# Altium schematic sheet E17-15-CONN.SchDoc
size A; DocumentNumber: 3; SheetNumber: 3; SheetTotal: 9
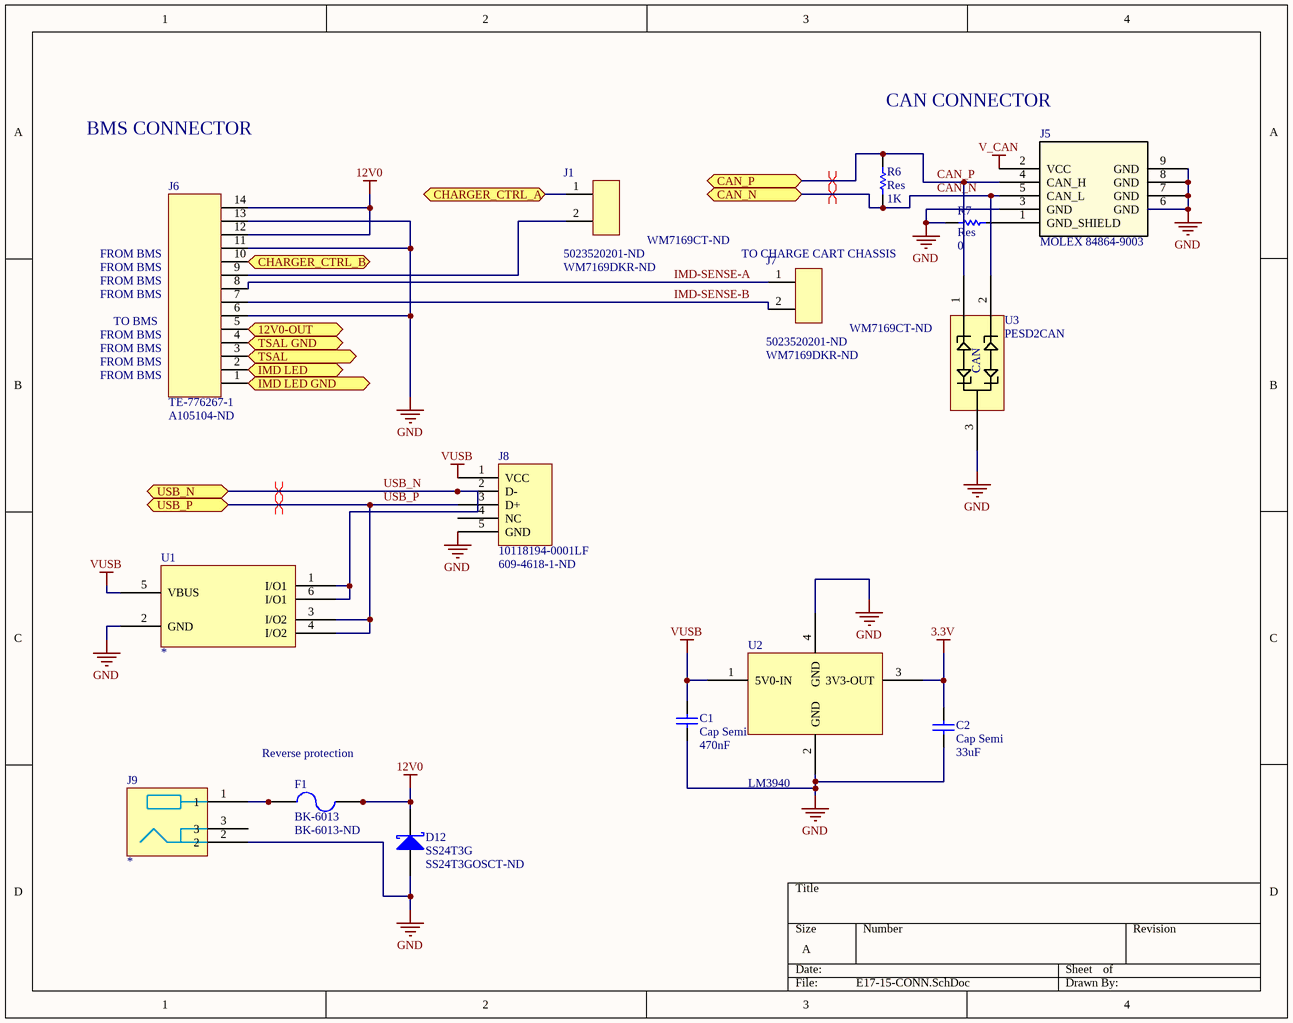
[diagram p0: E17-15-CONN.SchDoc]

## Parts
C1  Cap Semi  value 470nF  [C1206]
C2  Cap Semi  value 33uF  [C1206]
D12  SS24T3G  Supplier Part Number 1: SS24T3GOSCT-ND  [DO-214-AA]
F1  BK-6013  Supplier Part Number 1: BK-6013-ND  [BK-6013]
J1  Supplier Part Number 1: 5023520201-ND  Supplier Part Number 2: WM7169DKR-ND  [MOLEX_DURACLIK_2]  (hidden comment: J_5023520200)
J5  MOLEX 84864-9003  [MOLEX 84864-9003]
J6  TE-776267-1  Supplier Part Number 1: A105104-ND  [TE-776267-1]
J7  Supplier Part Number 1: 5023520201-ND  Supplier Part Number 2: WM7169DKR-ND  [MOLEX_DURACLIK_2]  (hidden comment: J_5023520200)
J8  10118194-0001LF  Supplier Part Number 1: 609-4618-1-ND  [10118194-0001LF]
J9  *  [EJ805A]
R6  Res  value 1K  [2012[0805]]
R7  Res  value 0  [2012[0805]]
U1  *  [SOP6]
U2  LM3940  [TO-263-3]
U3  PESD2CAN  [SOT95P230X110-3N]

## Ports
12V0-OUT (in), CAN_N (bidir), CAN_P (bidir), CHARGER_CTRL_A (bidir), CHARGER_CTRL_B (bidir), IMD LED (in), IMD LED GND (in), TSAL (in), TSAL GND (in), USB_N (bidir), USB_P (bidir)

## Nets
3.3V: C2.2 U2.3(3V3-OUT)
12V0: D12.2(K) F1.3 F1.4 J6.12 J6.14
GND: C1.1 C2.1 D12.1(A) J5.3(GND) J5.6(GND) J5.7(GND) J5.8(GND) J5.9(GND) J6.6 J6.11 J6.13 J8.5(GND) J9.2 R7.1 U1.2(GND) U2.2(GND) U2.4(GND) U3.3(COM)
V_CAN: J5.2(VCC)
VUSB: C1.2 J8.1(VCC) U1.5(VBUS) U2.1(5V0-IN)
12V0-OUT: J6.5 ; port 12V0-OUT
CAN_N: J5.5(CAN_L) R6.1 U3.2(CATH2) ; port CAN_N
CAN_P: J5.4(CAN_H) R6.2 U3.1(CATH1) ; port CAN_P
CHARGER_CTRL_A: J1.1 ; port CHARGER_CTRL_A
CHARGER_CTRL_B: J6.10 ; port CHARGER_CTRL_B
IMD LED: J6.2 ; port IMD LED
IMD LED GND: J6.1 ; port IMD LED GND
IMD-SENSE-A: J6.8 J7.1
IMD-SENSE-B: J6.7 J7.2
TSAL: J6.3 ; port TSAL
TSAL GND: J6.4 ; port TSAL GND
USB_N: J8.2(D-) U1.1(I/O1) U1.6(I/O1) ; port USB_N
USB_P: J8.3(D+) U1.3(I/O2) U1.4(I/O2) ; port USB_P
NetF1_1: F1.1 F1.2 J9.1
NetJ1_2: J1.2 J6.9
NetJ5_1: J5.1(GND_SHIELD) R7.2

Not connected (* = marked no-connect by the designer): J8 4(NC); J9 3

## Layout directives
differential pair: CAN_N, CAN_P, USB_N, USB_P

## Notes on the sheet
- BMS CONNECTOR
- CAN CONNECTOR
- FROM BMS
- (near J7) TO CHARGE CART CHASSIS
- TO BMS
- (near F1) Reverse protection
- (in symbol PESD2CAN) CAN

## Library data of the parts
C1 C2 = Cap Semi: Capacitor (Semiconductor SIM Model); Published: 8-Jun-2000; LatestRevisionDate: 29-May-2009; LatestRevisionNote: IPC-7351 Footprint Added.; PackageReference: C1206; Publisher: Altium Limited; PackageDescription: Chip Capacitor
D12 = SS24T3G: Schottky Diode; Published: 8-Jun-2000; LatestRevisionDate: 17-Jul-2002; LatestRevisionNote: Re-released for DXP Platform.; PackageReference: SMB; Publisher: Altium Limited; Code_JEDEC: DO-214-AA; Supplier 1: Digi-Key
F1 = BK-6013: FUSE HOLDER BLADE PCB; Supplier 1: Digi-Key
J1 J7 = J_5023520200: MOLEX DURACLIK 2-PIN RA; Digikey_PN: WM7169CT-ND; Supplier 1: Digi-Key; Supplier 2: Digi-Key
J5 = MOLEX 84864-9003: CAN Micro-Change M12, Right Angle, Male
J6 = TE-776267-1: CONN HEADER 14POS R/A TIN BLK; Supplier 1: Digi-Key
J8 = 10118194-0001LF: CONN USB MICRO B RECPT SMT R/A; Supplier 1: Digi-Key
J9 = EJ508A: CONN PWR JACK 2.1X5.5MM SOLDER
R6 R7 = Res: Surface Mount Resistor; Published: 8-Jun-2000; LatestRevisionDate: 17-Jul-2002; LatestRevisionNote: Re-released for DXP Platform.; PackageReference: AXIAL-0.5; Publisher: Altium Limited
U1 = USBL6-2